# Altium schematic sheet 23D_ESC_DRIVER.SchDoc
size A3
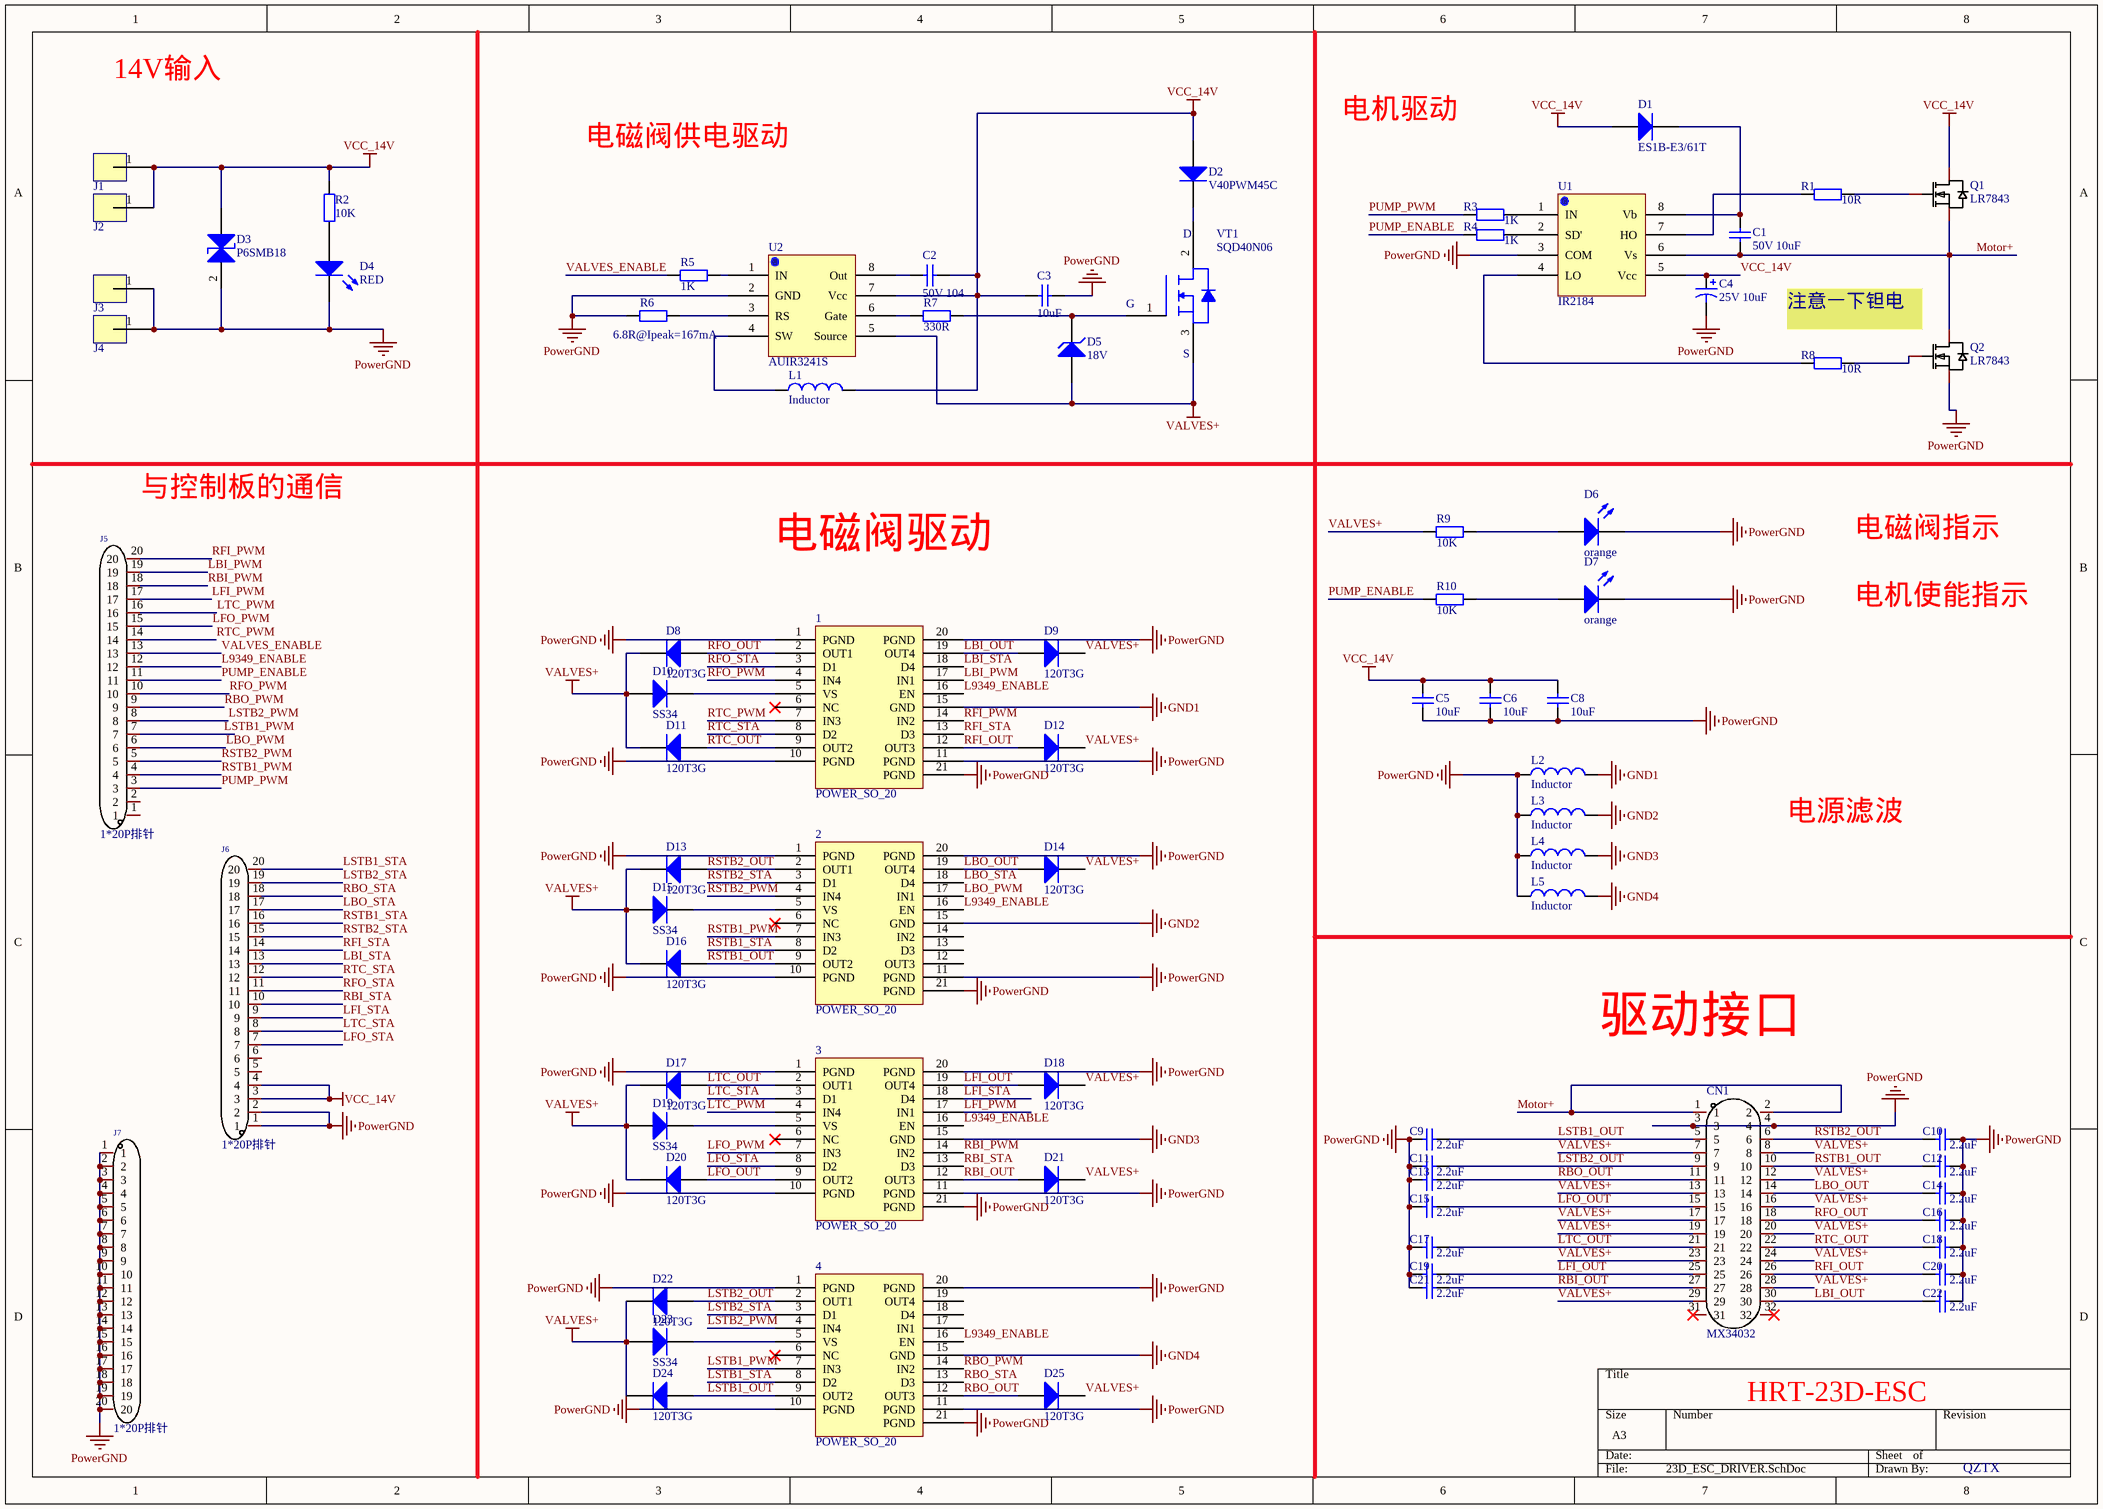
[diagram p0: 23D_ESC_DRIVER.SchDoc]

## Parts
1  POWER_SO_20  [POWERSO-20_L15.9-W11.0-P1.27-LS14.2-BL-EP]
2  POWER_SO_20  [POWERSO-20_L15.9-W11.0-P1.27-LS14.2-BL-EP]
3  POWER_SO_20  [POWERSO-20_L15.9-W11.0-P1.27-LS14.2-BL-EP]
4  POWER_SO_20  [POWERSO-20_L15.9-W11.0-P1.27-LS14.2-BL-EP]
C1  50V 10uF  [C 0805]
C2  50V 104  [C 0805]
C3  10uF  [C 0805]
C4  25V 10uF  [CP 3528B]
C5  10uF  [C 0805]
C6  10uF  [C 0805]
C8  10uF  [C 0805]
C9  2.2uF  [C 0805]
C10  2.2uF  [C 0805]
C11  2.2uF  [C 0805]
C12  2.2uF  [C 0805]
C13  2.2uF  [C 0805]
C14  2.2uF  [C 0805]
C15  2.2uF  [C 0805]
C16  2.2uF  [C 0805]
C17  2.2uF  [C 0805]
C18  2.2uF  [C 0805]
C19  2.2uF  [C 0805]
C20  2.2uF  [C 0805]
C21  2.2uF  [C 0805]
C22  2.2uF  [C 0805]
CN1  Name: MX34032  [CONN-TH_MX34032NF2]  (hidden comment: MX34032NF2)
D1  ES1B-E3/61T  [DO-214]
D2  V40PWM45C  [TO252_DIO]
D3  P6SMB18  [DO-214AA]
D4  RED  [LED_0805]
D5  18V  [LL34]
D6  orange  [LED_0805]
D7  orange  [LED_0805]
D8  120T3G  [DO-214]
D9  120T3G  [DO-214]
D10  SS34  [DO-214]
D11  120T3G  [DO-214]
D12  120T3G  [DO-214]
D13  120T3G  [DO-214]
D14  120T3G  [DO-214]
D15  SS34  [DO-214]
D16  120T3G  [DO-214]
D17  120T3G  [DO-214]
D18  120T3G  [DO-214]
D19  SS34  [DO-214]
D20  120T3G  [DO-214]
D21  120T3G  [DO-214]
D22  120T3G  [DO-214]
D23  SS34  [DO-214]
D24  120T3G  [DO-214]
D25  120T3G  [DO-214]
J1  SMT_Connector  [SMT_Connector]  (value not drawn)
J2  SMT_Connector  [SMT_Connector]  (value not drawn)
J3  SMT_Connector  [SMT_Connector]  (value not drawn)
J4  SMT_Connector  [SMT_Connector]  (value not drawn)
J5  Name: 1*20P排针  [HDR-TH_20P-P2.54-V-M-1]  (hidden comment: 2.54-1*20P直针)
J6  Name: 1*20P排针  [HDR-TH_20P-P2.54-V-M-1]  (hidden comment: 2.54-1*20P直针)
J7  Name: 1*20P排针  [HDR2.54-LI-20P]  (hidden comment: 2.54-1*20P直针)
L1  Inductor  [L 0805]
L2  Inductor  [L 0805]
L3  Inductor  [L 0805]
L4  Inductor  [L 0805]
L5  Inductor  [L 0805]
Q1  Name: LR7843  [TO-252-2_L6.6-W6.1-P4.58-LS9.9-BR]  (hidden comment: LR7843-VB)
Q2  Name: LR7843  [TO-252-2_L6.6-W6.1-P4.58-LS9.9-BR]  (hidden comment: LR7843-VB)
R1  10R  [R 0805]
R2  10K  [R 0805]
R3  1K  [R 0805]
R4  1K  [R 0805]
R5  1K  [R 0805]
R6  6.8R@Ipeak=167mA  [R 0805]
R7  330R  [R 0805]
R8  10R  [R 0805]
R9  10K  [R 0805]
R10  10K  [R 0805]
U1  IR2184  [SOP8]
U2  AUIR3241S  [SOP8]
VT1  SQD40N06  [TO252]

## Nets
GND1: 1.15(GND) L2.2
GND2: 2.15(GND) L3.2
GND3: 3.15(GND) L4.2
GND4: 4.15(GND) L5.2
PowerGND: 1.1(PGND) 1.10(PGND) 1.11(PGND) 1.20(PGND) 1.21(PGND) 2.1(PGND) 2.10(PGND) 2.11(PGND) 2.20(PGND) 2.21(PGND) 3.1(PGND) 3.10(PGND) 3.11(PGND) 3.20(PGND) 3.21(PGND) 4.1(PGND) 4.10(PGND) 4.11(PGND) 4.20(PGND) 4.21(PGND) C3.2 C4.2 C5.1 C6.1 C8.1 C9.1 C10.2 C11.1 C12.2 C13.1 C14.2 C15.1 C16.2 C17.1 C18.2 C19.1 C20.2 C21.1 C22.2 CN1.3 CN1.4 D3.2(K) D4.2(K) D6.2(K) D7.2(K) J3.1 J4.1 J6.1 J6.2 J7.1 J7.2 J7.3 J7.4 J7.5 J7.6 J7.7 J7.8 J7.9 J7.10 J7.11 J7.12 J7.13 J7.14 J7.15 J7.16 J7.17 J7.18 J7.19 J7.20 L2.1 L3.1 L4.1 L5.1 Q2.3(S) R6.1 U1.3(COM) U2.2(GND)
VALVES+: CN1.7 CN1.8 CN1.12 CN1.13 CN1.16 CN1.17 CN1.19 CN1.20 CN1.23 CN1.24 CN1.28 CN1.29 D5.1(A) D8.2(K) D9.2(K) D10.1(A) D11.2(K) D12.2(K) D13.2(K) D14.2(K) D15.1(A) D16.2(K) D17.2(K) D18.2(K) D19.1(A) D20.2(K) D21.2(K) D22.2(K) D23.1(A) D24.2(K) D25.2(K) R9.1 U2.5(Source) VT1.3
VCC_14V: C2.2 C3.1 C4.1 C5.2 C6.2 C8.2 D1.1(A) D2.1(A) D3.1(A) J1.1 J2.1 J6.3 J6.4 L1.2 Q1.2(D) R2.2 U1.5(Vcc) U2.7(Vcc)
L9349_ENABLE: 1.16(EN) 2.16(EN) 3.16(EN) 4.16(EN) J5.12
LBI_OUT: 1.19(OUT4) C22.1 CN1.30 D9.1(A)
LBI_PWM: 1.17(IN1) J5.19
LBI_STA: 1.18(D4) J6.13
LBO_OUT: 2.19(OUT4) C14.1 CN1.14 D14.1(A)
LBO_PWM: 2.17(IN1) J5.6
LBO_STA: 2.18(D4) J6.17
LFI_OUT: 3.19(OUT4) C19.2 CN1.25 D18.1(A)
LFI_PWM: 3.17(IN1) J5.17
LFI_STA: 3.18(D4) J6.9
LFO_OUT: 3.9(OUT2) C15.2 CN1.15 D20.1(A)
LFO_PWM: 3.7(IN3) J5.15
LFO_STA: 3.8(D2) J6.7
LSTB1_OUT: 4.9(OUT2) C9.2 CN1.5 D24.1(A)
LSTB1_PWM: 4.7(IN3) J5.7
LSTB1_STA: 4.8(D2) J6.20
LSTB2_OUT: 4.2(OUT1) C11.2 CN1.9 D22.1(A)
LSTB2_PWM: 4.4(IN4) J5.8
LSTB2_STA: 4.3(D1) J6.19
LTC_OUT: 3.2(OUT1) C17.2 CN1.21 D17.1(A)
LTC_PWM: 3.4(IN4) J5.16
LTC_STA: 3.3(D1) J6.8
Motor+: C1.1 CN1.1 CN1.2 Q1.3(S) Q2.2(D) U1.6(Vs)
PUMP_ENABLE: J5.11 R4.1 R10.1
PUMP_PWM: J5.3 R3.1
RBI_OUT: 3.12(OUT3) C21.2 CN1.27 D21.1(A)
RBI_PWM: 3.14(IN2) J5.18
RBI_STA: 3.13(D3) J6.10
RBO_OUT: 4.12(OUT3) C13.2 CN1.11 D25.1(A)
RBO_PWM: 4.14(IN2) J5.9
RBO_STA: 4.13(D3) J6.18
RFI_OUT: 1.12(OUT3) C20.1 CN1.26 D12.1(A)
RFI_PWM: 1.14(IN2) J5.20
RFI_STA: 1.13(D3) J6.14
RFO_OUT: 1.2(OUT1) C16.1 CN1.18 D8.1(A)
RFO_PWM: 1.4(IN4) J5.10
RFO_STA: 1.3(D1) J6.11
RSTB1_OUT: 2.9(OUT2) C12.1 CN1.10 D16.1(A)
RSTB1_PWM: 2.7(IN3) J5.4
RSTB1_STA: 2.8(D2) J6.16
RSTB2_OUT: 2.2(OUT1) C10.1 CN1.6 D13.1(A)
RSTB2_PWM: 2.4(IN4) J5.5
RSTB2_STA: 2.3(D1) J6.15
RTC_OUT: 1.9(OUT2) C18.1 CN1.22 D11.1(A)
RTC_PWM: 1.7(IN3) J5.14
RTC_STA: 1.8(D2) J6.12
VALVES_ENABLE: J5.13 R5.1
Net1_5: 1.5(VS) D10.2(K)
Net2_5: 2.5(VS) D15.2(K)
Net3_5: 3.5(VS) D19.2(K)
Net4_5: 4.5(VS) D23.2(K)
NetC1_2: C1.2 D1.2(K) U1.8(Vb)
NetC2_1: C2.1 U2.8(Out)
NetD2_2: D2.2(K) VT1.2
NetD4_1: D4.1(A) R2.1
NetD5_2: D5.2(K) R7.2 VT1.1(G)
NetD6_1: D6.1(A) R9.2
NetD7_1: D7.1(A) R10.2
NetL1_1: L1.1 U2.4(SW)
NetQ1_1: Q1.1(G) R1.2
NetQ2_1: Q2.1(G) R8.2
NetR1_1: R1.1 U1.7(HO)
NetR3_2: R3.2 U1.1(IN)
NetR4_2: R4.2 U1.2(SD')
NetR5_2: R5.2 U2.1(IN)
NetR6_2: R6.2 U2.3(RS)
NetR7_1: R7.1 U2.6(Gate)
NetR8_1: R8.1 U1.4(LO)

Not connected (* = marked no-connect by the designer): 1 6(NC)*; 2 6(NC)* 12(OUT3) 13(D3) 14(IN2); 3 6(NC)*; 4 6(NC)* 17(IN1) 18(D4) 19(OUT4); CN1 31* 32*; J5 1 2; J6 5 6

## Notes on the sheet
- 14V输入
- 电磁阀供电驱动
- 电机驱动
- (near Q2) 注意一下钽电容的封装
- 与控制板的通信
- 电磁阀驱动
- 电磁阀指示
- 电机使能指示
- 电源滤波
- 驱动接口
- HRT-23D-ESC
- QZTX
- (in symbol PowerMos_N) D; S

## Library data of the parts
C1-C3 C5 C6 C8-C22 = Cap: 无极性电容
C4 = Cap_Pol: 极性电容
CN1 = MX34032NF2: 间距:2.2mm;插针结构:2x16P;排数:2;每排PIN数:16;行距:3mm;公母:公型插针;安装方式:弯插;; Manufacturer: JAE(日本航空电子); Add into BOM: yes; Pitch: 2.2mm; Pins Structure: 2x16P; Number of PINs Per Row: 16; Row Spacing: 3mm; Gender: 公型插针; Symbol: MX34032NF2; Device: MX34032NF2; LCSC Part Name: 2.2mm 2x16P 弯插; Supplier Part: C461464; Manufacturer Part: MX34032NF2; Supplier Footprint: 弯插,P=2.2mm(交错脚); JLCPCB Part Class: 扩展库; Datasheet: https://atta.szlcsc.com/upload/public/pdf/source/20191125/C461464_E16D5CF94FC82895A5208D85BE19BEE8.pdf; Supplier: LCSC; Convert to PCB: yes; Number of Rows: 2; Mounting Style: 弯插
D1 D2 D8-D25 = Diode: 二极管
D3 = P6SMBXX: BiDir TVS Diode
D4 D6 D7 = LED: 发光二极管
D5 = Diode_Zener
J1-J4 = SMT_Connector: 表贴接线端
J5-J7 = 2.54-1*20P直针: 排数:单排;总PIN位数:20;间距:2.54mm;插针结构:1x20P;行距:-;安装类型:直插;圆针/方针:方针;额定电流:3A;额定电压:-;配合针长度:-;塑高:-;端接针长度:-;触头材质:黄铜;触头镀层:-;工作温度范围:-40℃~+105℃;颜色:黑色;; Manufacturer: BOOMELE(博穆精密); Symbol: Header-Male-2.54_1x20; Add into BOM: yes; Pitch: 2.54mm; Pin Structure: 1x20P; Circluar Pins/Square Pins: 方针; Current Rating (Max): 3A; Device: 2.54-1*20P直针; LCSC Part Name: 2.54mm 1x20P 直插 方针; Supplier Part: C50981; Manufacturer Part: 2.54-1*20P直针; Supplier Footprint: 直插,P=2.54mm; JLCPCB Part Class: 扩展库; Supplier: LCSC; Convert to PCB: yes; Number of Rows: 单排; Number of Pins: 20; Row Spacing: -; Mounting Type: 直插; Voltage Rating (Max): -; Length of Mating Pin: -; Insulation Height: -; Length of End Connection Pin: -; Contact Material: 黄铜; Contact Plating: -; Operating Temperature Range: -40℃~+105℃; Color: 黑色
L1-L5 = Inductor: 电感
Q1 Q2 = LR7843-VB: 类型:N沟道;漏源电压(Vdss):30V;连续漏极电流(Id):120A;导通电阻(RDS(on)@Vgs,Id):2.3mΩ@10V,120A;; Manufacturer: VBsemi(微碧); Add into BOM: yes; Type: N沟道; Drain Source Voltage (Vdss): 30V; Symbol: LR7843; Device: LR7843-VB; LCSC Part Name: N沟道 30V 120A; Supplier Part: C5137375; Manufacturer Part: LR7843-VB; Supplier Footprint: TO-252; JLCPCB Part Class: 扩展库; Datasheet: https://atta.szlcsc.com/upload/public/pdf/source/20220817/5F193B2A50E1B5079520877958D5ECE3.pdf; Supplier: LCSC; Convert to PCB: yes; Continuous Drain Current (Id): 120A; Drain Source On Resistance (RDS(on)@Vgs,Id): 2.3mΩ@10V,120A
R1-R10 = Resistor: 电阻
U1 = IR2184: Half-Bridge Gate Driver
U2 = AUIR3241S: B2B MOSFET Driver
VT1 = PowerMos_N